# EAGLE schematic EuclideanSequencer (EAGLE 9.6.1)
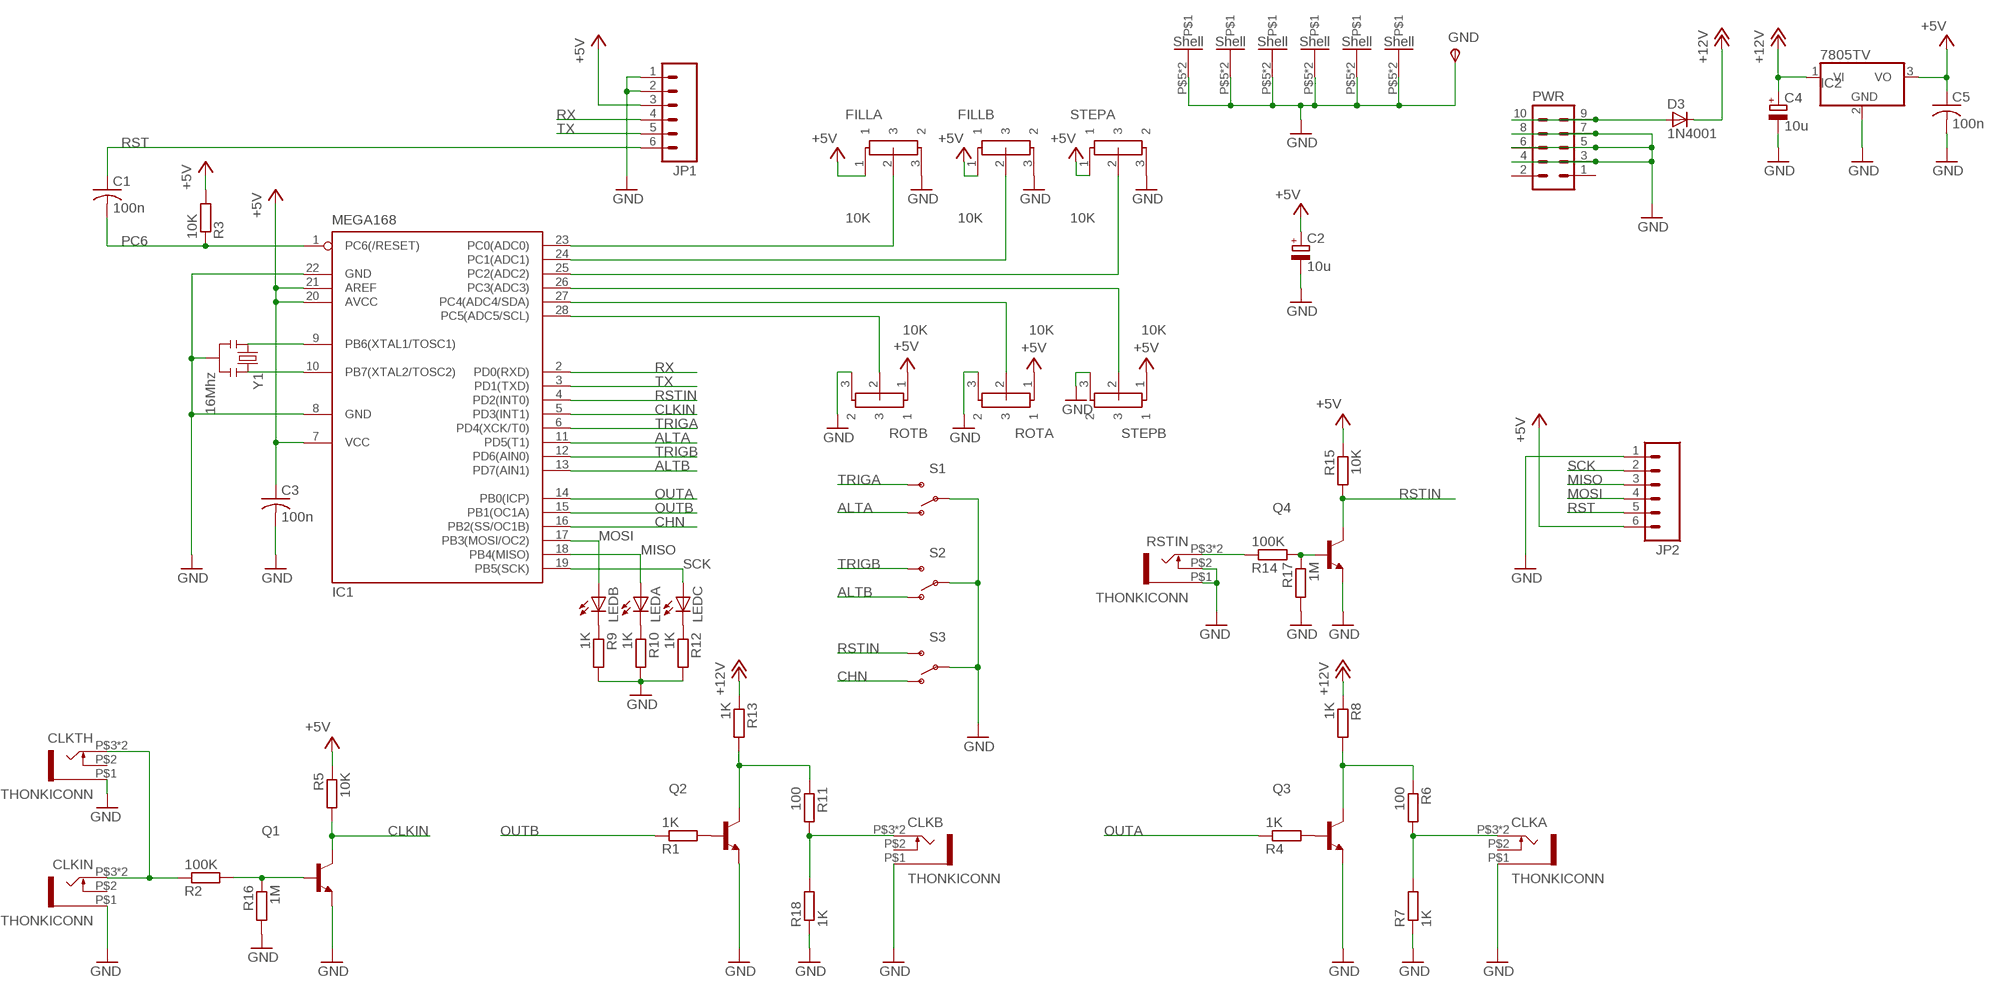
[diagram p0: schematic, sheet 1]

## Parts
C1  100n  C-US050-024X044  [C050-024X044]
C2  10u  CPOL-EUE5-6  [E5-6]
C3  100n  C-US050-024X044  [C050-024X044]
C4  10u  CPOL-EUE5-6  [E5-6]
C5  100n  C-US050-024X044  [C050-024X044]
CLKA  THONKICONN  [THONKICONN]
CLKB  THONKICONN  [THONKICONN]
CLKIN  THONKICONN  [THONKICONN]
CLKTH  THONKICONN  [THONKICONN]
D3  1N4001  DIODE1N4001  [DIODE-1N4001]
FILLA  10K  POT-ALPS_ALPS290024  [POT-ALPS-RK09L1140]
FILLB  10K  POT-ALPS_ALPS290024  [POT-ALPS-RK09L1140]
GND  TPSPAD1-20  [P1-20]
IC1  MEGA168  MEGA8-P  [DIL28-3]
IC2  7805TV  [TO220V]
JP1  M06SIP  [1X06]
JP2  M06SIP  [1X06]
LEDA  LED3MM  [LED3MM]
LEDB  LED3MM  [LED3MM]
LEDC  LED3MM  [LED3MM]
PWR  MA05-2  [MA05-2]
Q1  2N3904-NPN-TO92-EBC  [TO92-EBC]
Q2  2N3904-NPN-TO92-EBC  [TO92-EBC]
Q3  2N3904-NPN-TO92-EBC  [TO92-EBC]
Q4  2N3904-NPN-TO92-EBC  [TO92-EBC]
R1  1K  R-EU_0204/7  [0204/7]
R2  100K  R-EU_0204/7  [0204/7]
R3  10K  R-EU_0204/7  [0204/7]
R4  1K  R-EU_0204/7  [0204/7]
R5  10K  R-EU_0204/7  [0204/7]
R6  100  R-EU_0204/7  [0204/7]
R7  1K  R-EU_0204/7  [0204/7]
R8  1K  R-EU_0204/7  [0204/7]
R9  1K  R-EU_0204/7  [0204/7]
R10  1K  R-EU_0204/7  [0204/7]
R11  100  R-EU_0204/7  [0204/7]
R12  1K  R-EU_0204/7  [0204/7]
R13  1K  R-EU_0204/7  [0204/7]
R14  100K  R-EU_0204/7  [0204/7]
R15  10K  R-EU_0204/7  [0204/7]
R16  1M  R-EU_0204/7  [0204/7]
R17  1M  R-EU_0204/7  [0204/7]
R18  1K  R-EU_0204/7  [0204/7]
ROTA  10K  POT-ALPS_ALPS290024  [POT-ALPS-RK09L1140]
ROTB  10K  POT-ALPS_ALPS290024  [POT-ALPS-RK09L1140]
RSTIN  THONKICONN  [THONKICONN]
S1  SWITCH-SPST  [SWITCH-SPDT-SALECOM-T8014]
S2  SWITCH-SPST  [SWITCH-SPDT-SALECOM-T8014]
S3  SWITCH-SPST  [SWITCH-SPDT-SALECOM-T8014]
STEPA  10K  POT-ALPS_ALPS290024  [POT-ALPS-RK09L1140]
STEPB  10K  POT-ALPS_ALPS290024  [POT-ALPS-RK09L1140]
Y1  16Mhz  RESONATORPTH  [RESONATOR-PTH]

## Nets
+5V: C2.+ C3.1 C5.1 FILLA.1 FILLB.1 IC1.7(VCC) IC1.20(AVCC) IC1.21(AREF) IC2.3(VO) JP1.3 JP2.6 R3.2 R5.1 R15.1 ROTA.1 ROTB.1 STEPA.1 STEPB.1
+12V: C4.+ D3.C IC2.1(VI) R8.1 R13.1
ALTA: IC1.11(PD5(T1)) S1.1(O)
ALTB: IC1.13(PD7(AIN1)) S2.1(O)
CHN: IC1.16(PB2(SS/OC1B)) S3.1(O)
CLKIN: IC1.5(PD3(INT1)) Q1.C R5.2
FILFB: FILLB.2 IC1.24(PC1(ADC1))
GND: C2.- C3.2 C4.- C5.2 CLKA.P$1 CLKB.P$1 CLKIN.P$1 CLKTH.P$1 FILLA.3 FILLA.P$5 FILLA.P$6 FILLB.3 FILLB.P$5 FILLB.P$6 GND.TP(PP) IC1.8(GND) IC1.22(GND) IC2.2(GND) JP1.1 JP1.2 JP2.1 PWR.3 PWR.4 PWR.5 PWR.6 PWR.7 PWR.8 Q1.E Q2.E Q3.E Q4.E R7.1 R9.2 R10.2 R12.2 R16.2 R17.2 R18.1 ROTA.3 ROTA.P$5 ROTA.P$6 ROTB.3 ROTB.P$5 ROTB.P$6 RSTIN.P$1 RSTIN.P$2 S1.2(P) S2.2(P) S3.2(P) STEPA.3 STEPA.P$5 STEPA.P$6 STEPB.3 STEPB.P$5 STEPB.P$6 Y1.2
MISO: IC1.18(PB4(MISO)) JP2.3 LEDA.A
MOSI: IC1.17(PB3(MOSI/OC2)) JP2.4 LEDB.A
N$1: FILLA.2 IC1.23(PC0(ADC0))
N$3: IC1.25(PC2(ADC2)) STEPA.2
N$4: IC1.26(PC3(ADC3)) STEPB.2
N$5: IC1.27(PC4(ADC4/SDA)) ROTA.2
N$6: IC1.28(PC5(ADC5/SCL)) ROTB.2
N$7: IC1.9(PB6(XTAL1/TOSC1)) Y1.1
N$8: IC1.10(PB7(XTAL2/TOSC2)) Y1.3
N$13: CLKB.P$3 CLKB.P$4 R11.2 R18.2
N$14: Q2.C R11.1 R13.2
N$17: Q1.B R2.2 R16.1
N$19: CLKIN.P$3 CLKIN.P$4 CLKTH.P$3 CLKTH.P$4 R2.1
N$20: R14.1 RSTIN.P$3 RSTIN.P$4
N$21: Q2.B R1.2
N$24: LEDB.K(C) R9.1
N$25: Q3.B R4.2
N$26: CLKA.P$3 CLKA.P$4 R6.2 R7.2
N$27: Q3.C R6.1 R8.2
N$28: LEDA.K(C) R10.1
N$30: LEDC.K(C) R12.1
N$32: Q4.B R14.2 R17.1
N$45: D3.A PWR.9 PWR.10
OUTA: IC1.14(PB0(ICP)) R4.1
OUTB: IC1.15(PB1(OC1A)) R1.1
PC6: C1.2 IC1.1(PC6(/RESET)) R3.1
RST: C1.1 JP1.6 JP2.5
RSTIN: IC1.4(PD2(INT0)) Q4.C R15.2 S3.3(S)
RX: IC1.2(PD0(RXD)) JP1.4
SCK: IC1.19(PB5(SCK)) JP2.2 LEDC.A
TRIGA: IC1.6(PD4(XCK/T0)) S1.3(S)
TRIGB: IC1.12(PD6(AIN0)) S2.3(S)
TX: IC1.3(PD1(TXD)) JP1.5
Unconnected: CLKA.P$2 CLKB.P$2 CLKIN.P$2 CLKTH.P$2 PWR.1 PWR.2

## Library data of the parts
C1 C3 C5 = rcl:C-US: CAPACITOR, American symbol
C2 C4 = rcl:CPOL-EU: POLARIZED CAPACITOR, European symbol
CLKA CLKB CLKIN CLKTH RSTIN = Rebel:THONKICONN
D3 = Rebel:DIODE: Diode These are standard reverse protection diodes and small signal diodes. SMA package can handle up to about 1A. SOD-323 can handle about 200mA. Watch the SOD-323 package when ordering, there are some mfgs out there that are 5-pin packages.
FILLA FILLB ROTA ROTB STEPA STEPB = Rebel:POT-ALPS_ALPS290024
GND = testpad:TPS: TEST PIN
IC1 = atmel:MEGA8-P: MICROCONTROLLER 8 Kbytes FLASH, 1 kbytes SRAM, 512 bytes EEPROM, USART, 4-channel 10 bit ADC, 2-channel 8 bit ADC Pin compatible with Atmega48, ATMega88, ATMega168 Source: avr.lbr; OC_FARNELL: unknown; OC_NEWARK: unknown
IC2 = linear:78*: Positive VOLTAGE REGULATOR Source: http://cache.national.com/ds/LM/LM78L05.pdf http://www.fairchildsemi.com/ds/LM/LM7805.pdf
JP1 JP2 = SparkFun:M06: Header 6 Standard 6-pin 0.1" header. Use with straight break away headers (SKU : PRT-00116), right angle break away headers (PRT-00553), swiss pins (PRT-00743), machine pins (PRT-00117), and female headers (PRT-00115). Molex polarized connector foot print use with SKU : PRT-08094 with associated crimp pins and housings. NOTES ON THE VARIANTS LOCK and LOCK_LONGPADS... This footprint was designed to help hold the alignment of a through-hole component (i.e. 6-pin header) while soldering it into place. You may notice that each hole has been shifted either up or down by 0.005 of an inch from it's more standard position (which is a perfectly straight line). This slight alteration caused the pins (the squares in the middle) to touch the edges of the holes. Because they are alternating, it causes a "brace" to hold the component in place. 0.005 has proven to be the perfect amount of "off-center" position when using our standard breakaway headers. Although looks a little odd when you look at the bare footprint, once you have a header in there, the alteration is very hard to notice. Also, if you push a header all the way into place, it is covered up entirely on the bottom side. This idea of altering the position of holes to aid alignment will be further integrated into the Sparkfun Library for other footprints. It can help hold any component with 3 or more connection pins.
LEDA LEDB LEDC = SparkFun:LED: LEDs Standard schematic elements and footprints for 5mm, 3mm, 1206, and 0603 sized LEDs. 5mm - Spark Fun Electronics SKU : COM-00529 (and others)
PWR = Rebel:MA05-2: PIN HEADER; OC_FARNELL: unknown; OC_NEWARK: unknown
Q1-Q4 = transistor-neu-to92:*-NPN-: NPN Transistror
R1-R18 = rcl:R-EU_: RESISTOR, European symbol
S1-S3 = Rebel:SWITCH-SPST: SPST Switch Simple slide switch. Spark Fun Electronics SKU : COM-00102
Y1 = SparkFun:RESONATOR: Resonator Small SMD resonator. This is the itty bitty 10/20MHz resonators with built in caps. CSTCE10M0G55 and CSTCE20M0V53. Footprint has been reviewed closely but hasn't been tested yet.